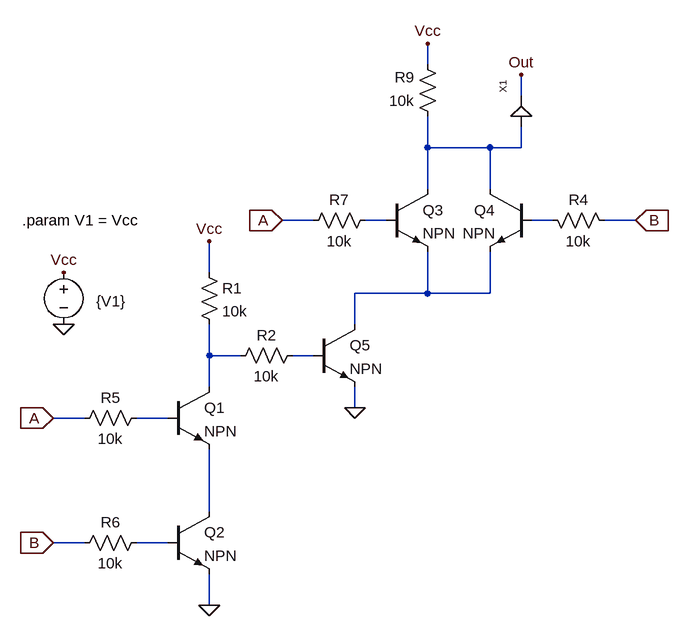
[diagram p0: schematic XNOR.asc]
XNOR.asc, the LTspice schematic file:
Version 4
SHEET 1 1328 680
WIRE 720 -384 720 -416
WIRE 864 -336 864 -368
WIRE 720 -256 720 -304
WIRE 816 -256 720 -256
WIRE 864 -256 864 -288
WIRE 864 -256 816 -256
WIRE 720 -192 720 -256
WIRE 816 -192 816 -256
WIRE 544 -144 496 -144
WIRE 656 -144 624 -144
WIRE 912 -144 880 -144
WIRE 1040 -144 992 -144
WIRE 384 -64 384 -112
WIRE 720 -32 720 -96
WIRE 720 -32 608 -32
WIRE 816 -32 816 -96
WIRE 816 -32 720 -32
WIRE 608 16 608 -32
WIRE 384 64 384 16
WIRE 432 64 384 64
WIRE 544 64 512 64
WIRE 384 112 384 64
WIRE 608 144 608 112
WIRE 192 160 144 160
WIRE 320 160 272 160
WIRE 384 304 384 208
WIRE 192 352 144 352
WIRE 320 352 272 352
WIRE 384 448 384 400
FLAG 496 -144 A
IOPIN 496 -144 In
FLAG 144 160 A
IOPIN 144 160 In
FLAG 144 352 B
IOPIN 144 352 In
FLAG 1040 -144 B
IOPIN 1040 -144 In
FLAG 864 -368 Out
FLAG 160 16 0
FLAG 160 -64 Vcc
FLAG 384 -112 Vcc
FLAG 720 -416 Vcc
FLAG 608 144 0
FLAG 384 448 0
SYMBOL npn 320 112 R0
SYMATTR InstName Q1
SYMBOL npn 320 304 R0
SYMATTR InstName Q2
SYMBOL npn 656 -192 R0
SYMATTR InstName Q3
SYMBOL npn 880 -192 M0
SYMATTR InstName Q4
SYMBOL npn 544 16 R0
SYMATTR InstName Q5
SYMBOL res 368 -80 R0
SYMATTR InstName R1
SYMATTR Value 10k
SYMBOL res 528 48 R90
WINDOW 0 0 56 VBottom 2
WINDOW 3 32 56 VTop 2
SYMATTR InstName R2
SYMATTR Value 10k
SYMBOL res 896 -160 M90
WINDOW 0 0 56 VBottom 2
WINDOW 3 32 56 VTop 2
SYMATTR InstName R4
SYMATTR Value 10k
SYMBOL res 288 144 R90
WINDOW 0 0 56 VBottom 2
WINDOW 3 32 56 VTop 2
SYMATTR InstName R5
SYMATTR Value 10k
SYMBOL res 288 336 R90
WINDOW 0 0 56 VBottom 2
WINDOW 3 32 56 VTop 2
SYMATTR InstName R6
SYMATTR Value 10k
SYMBOL res 640 -160 R90
WINDOW 0 0 56 VBottom 2
WINDOW 3 32 56 VTop 2
SYMATTR InstName R7
SYMATTR Value 10k
SYMBOL res 736 -288 R180
WINDOW 0 36 76 Left 2
WINDOW 3 36 40 Left 2
SYMATTR InstName R9
SYMATTR Value 10k
SYMBOL Buffer 864 -288 R270
SYMATTR InstName X1
SYMBOL voltage 160 -80 R0
WINDOW 0 24 16 Invisible 2
WINDOW 3 50 60 Left 2
SYMATTR InstName V1
SYMATTR Value {V1}
TEXT 96 -144 Left 2 !.param V1 = Vcc

The netlist it stands for:
* XNOR.asc
Q1 N005 N007 N008 0 NPN
Q2 N008 N009 0 0 NPN
Q3 N001 N002 N004 0 NPN
Q4 N001 N003 N004 0 NPN
Q5 N004 N006 0 0 NPN
R1 Vcc N005 10k
R2 N006 N005 10k
R4 N003 B 10k
R5 N007 A 10k
R6 N009 B 10k
R7 N002 A 10k
R9 N001 Vcc 10k
XX1 N001 Out Buffer Vcc = 5V  ; pins In Out
V1 Vcc 0 {V1}
.model NPN NPN
.model PNP PNP
.lib standard.bjt
.param V1 = Vcc
.backanno
.end